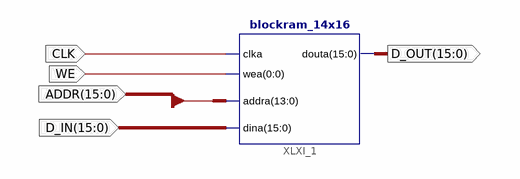
[diagram p0: schematic sheet 1]
// Xilinx ISE schematic ram_14x16.sch (spartan3e) as structural Verilog: 1 symbols, 5 ports
module ram_14x16 (
  input  [15:0] ADDR,
  input  WE,
  input  CLK,
  input  [15:0] D_IN,
  output [15:0] D_OUT
);

  blockram_14x16 XLXI_1 (.clka(CLK), .wea(WE), .addra(ADDR[13:0]), .dina(D_IN), .douta(D_OUT));
endmodule
